# EasyEDA Pro project BioWatch_PCB-DESKTOP-TT52GDR.eprj, schematic Schematic1

## Sheets
1 P1: Create Date: 2023-01-19; Page Name: P1; Project Name: Project Name; Schematic Name: Schematic Name; Update Date: 2021.11.05; Company: EasyEDA.com; Drawed: EasyEDA Pro; Page Size: A4; Part Number: JLCPCB-002; Reviewed: EasyEDA Pro; Version: V0.1
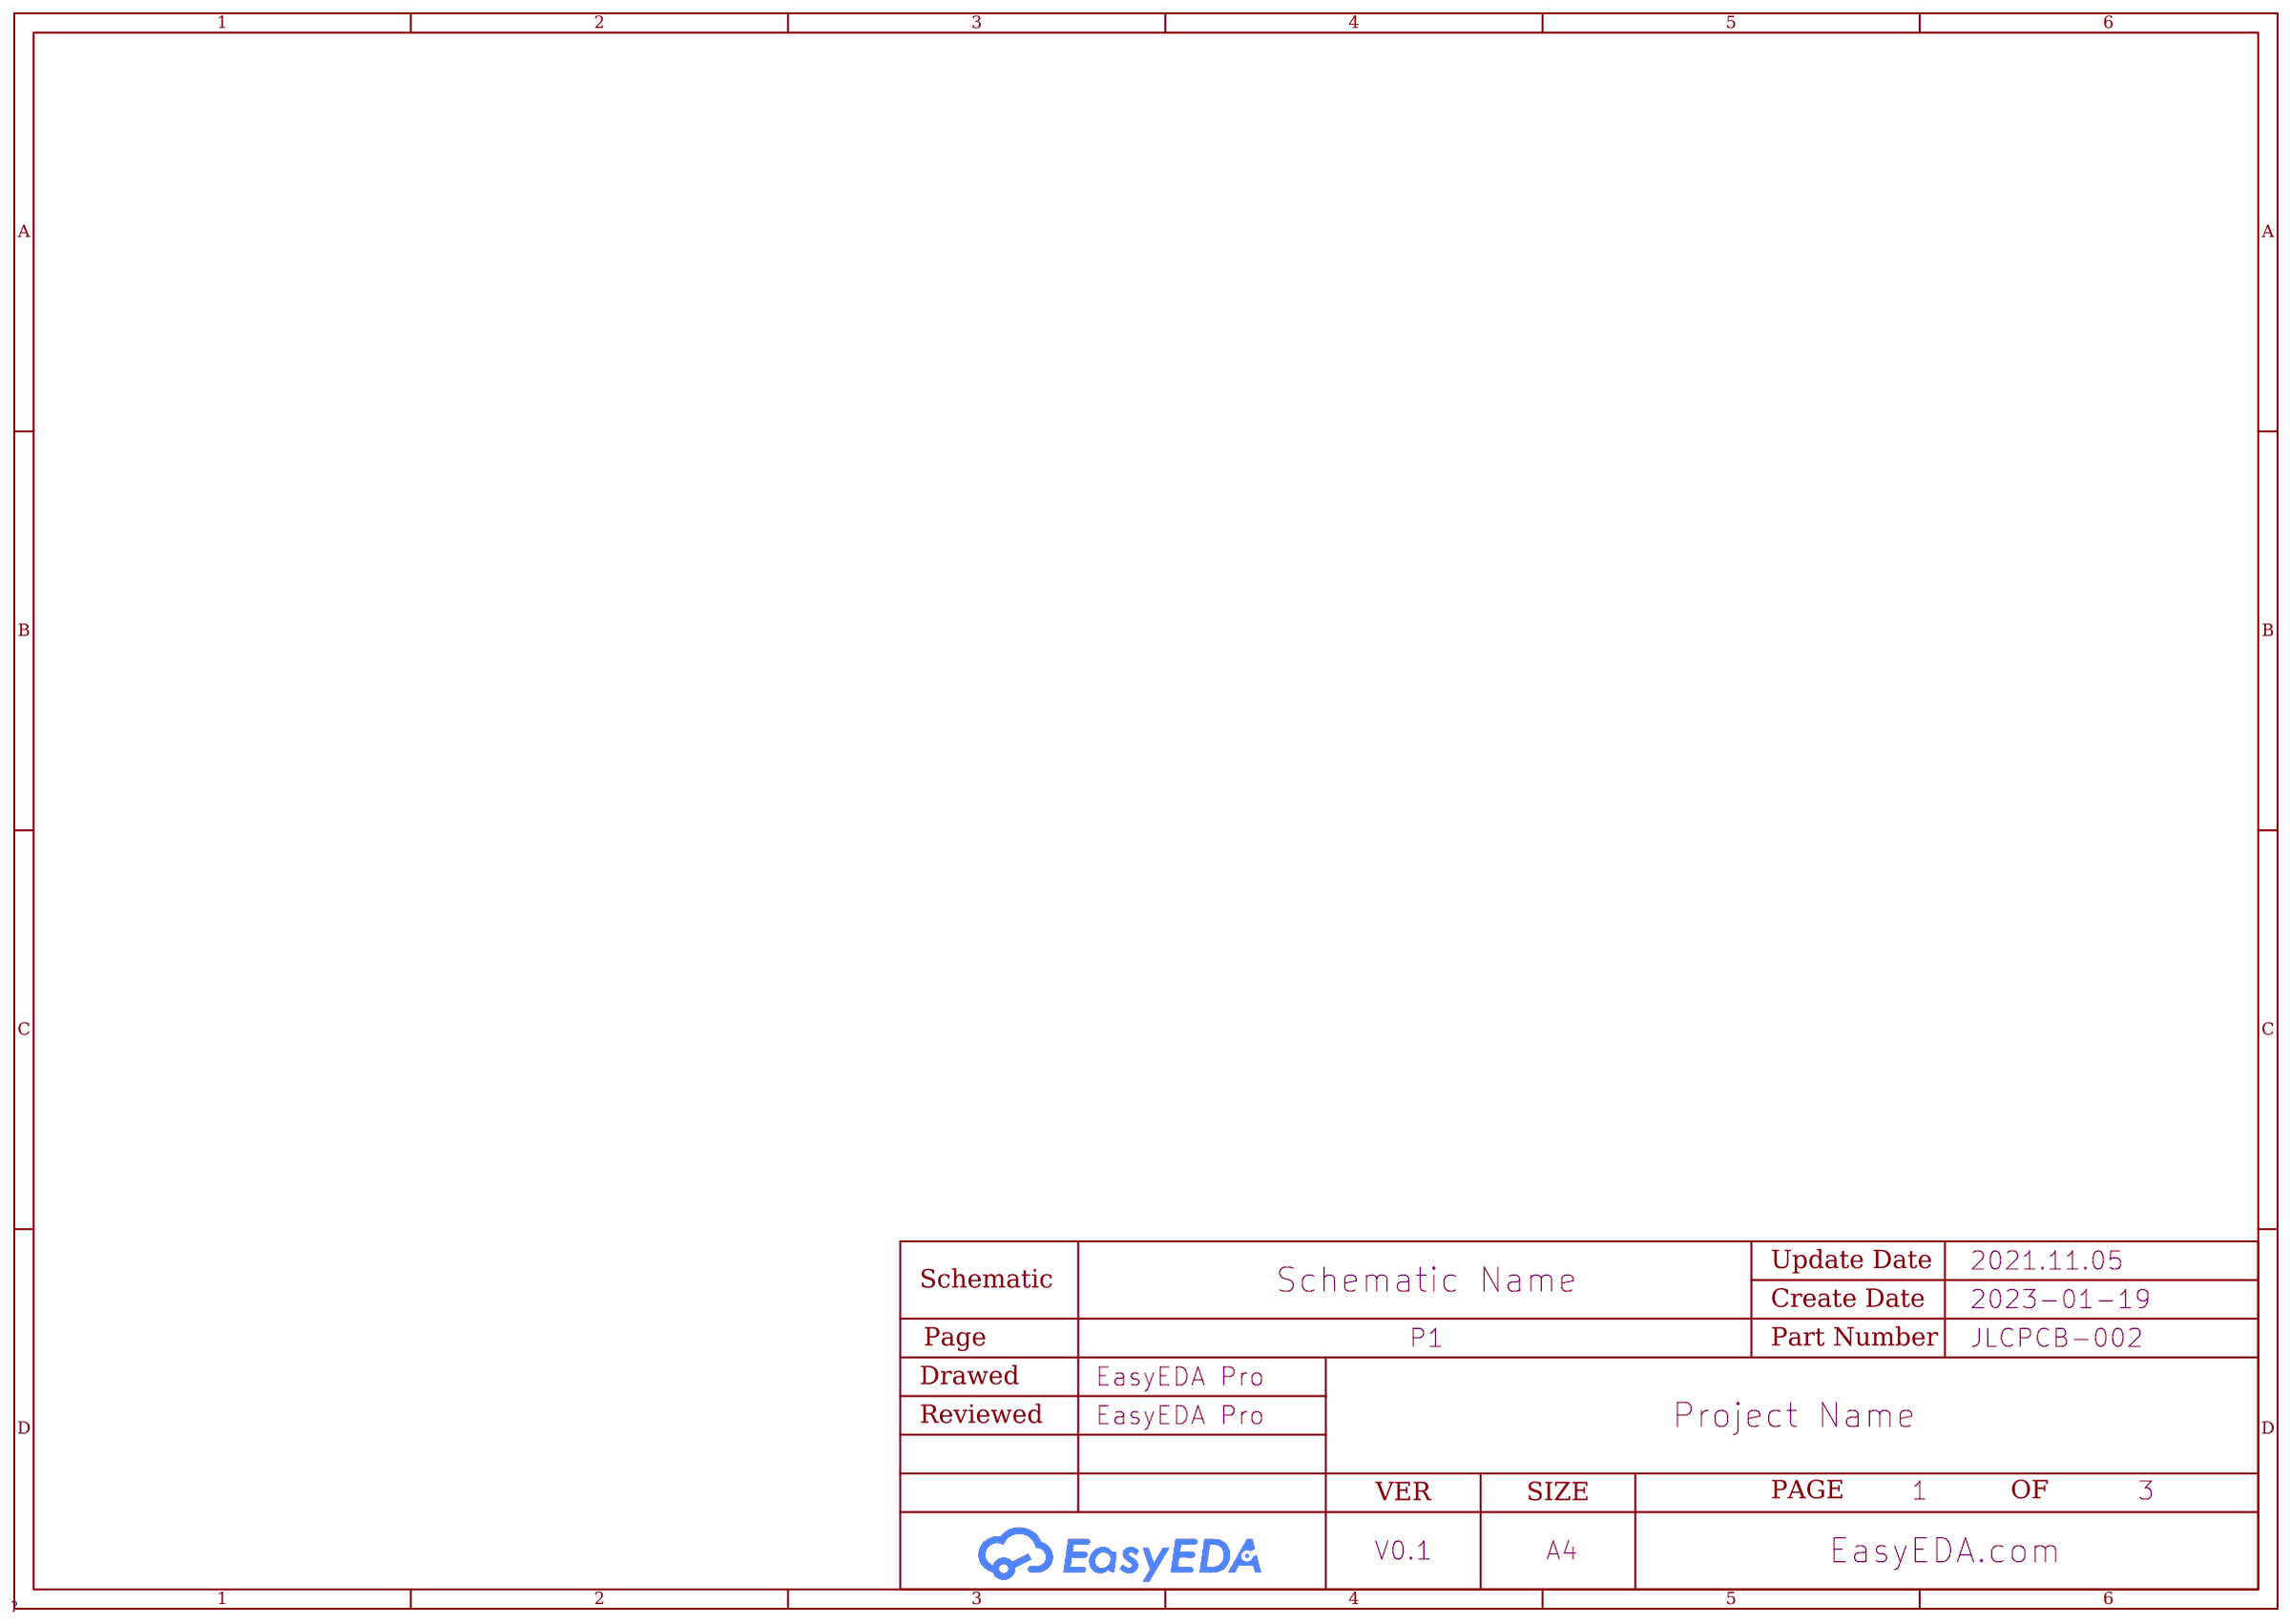
[diagram p1: P1]
2 Sheet_1
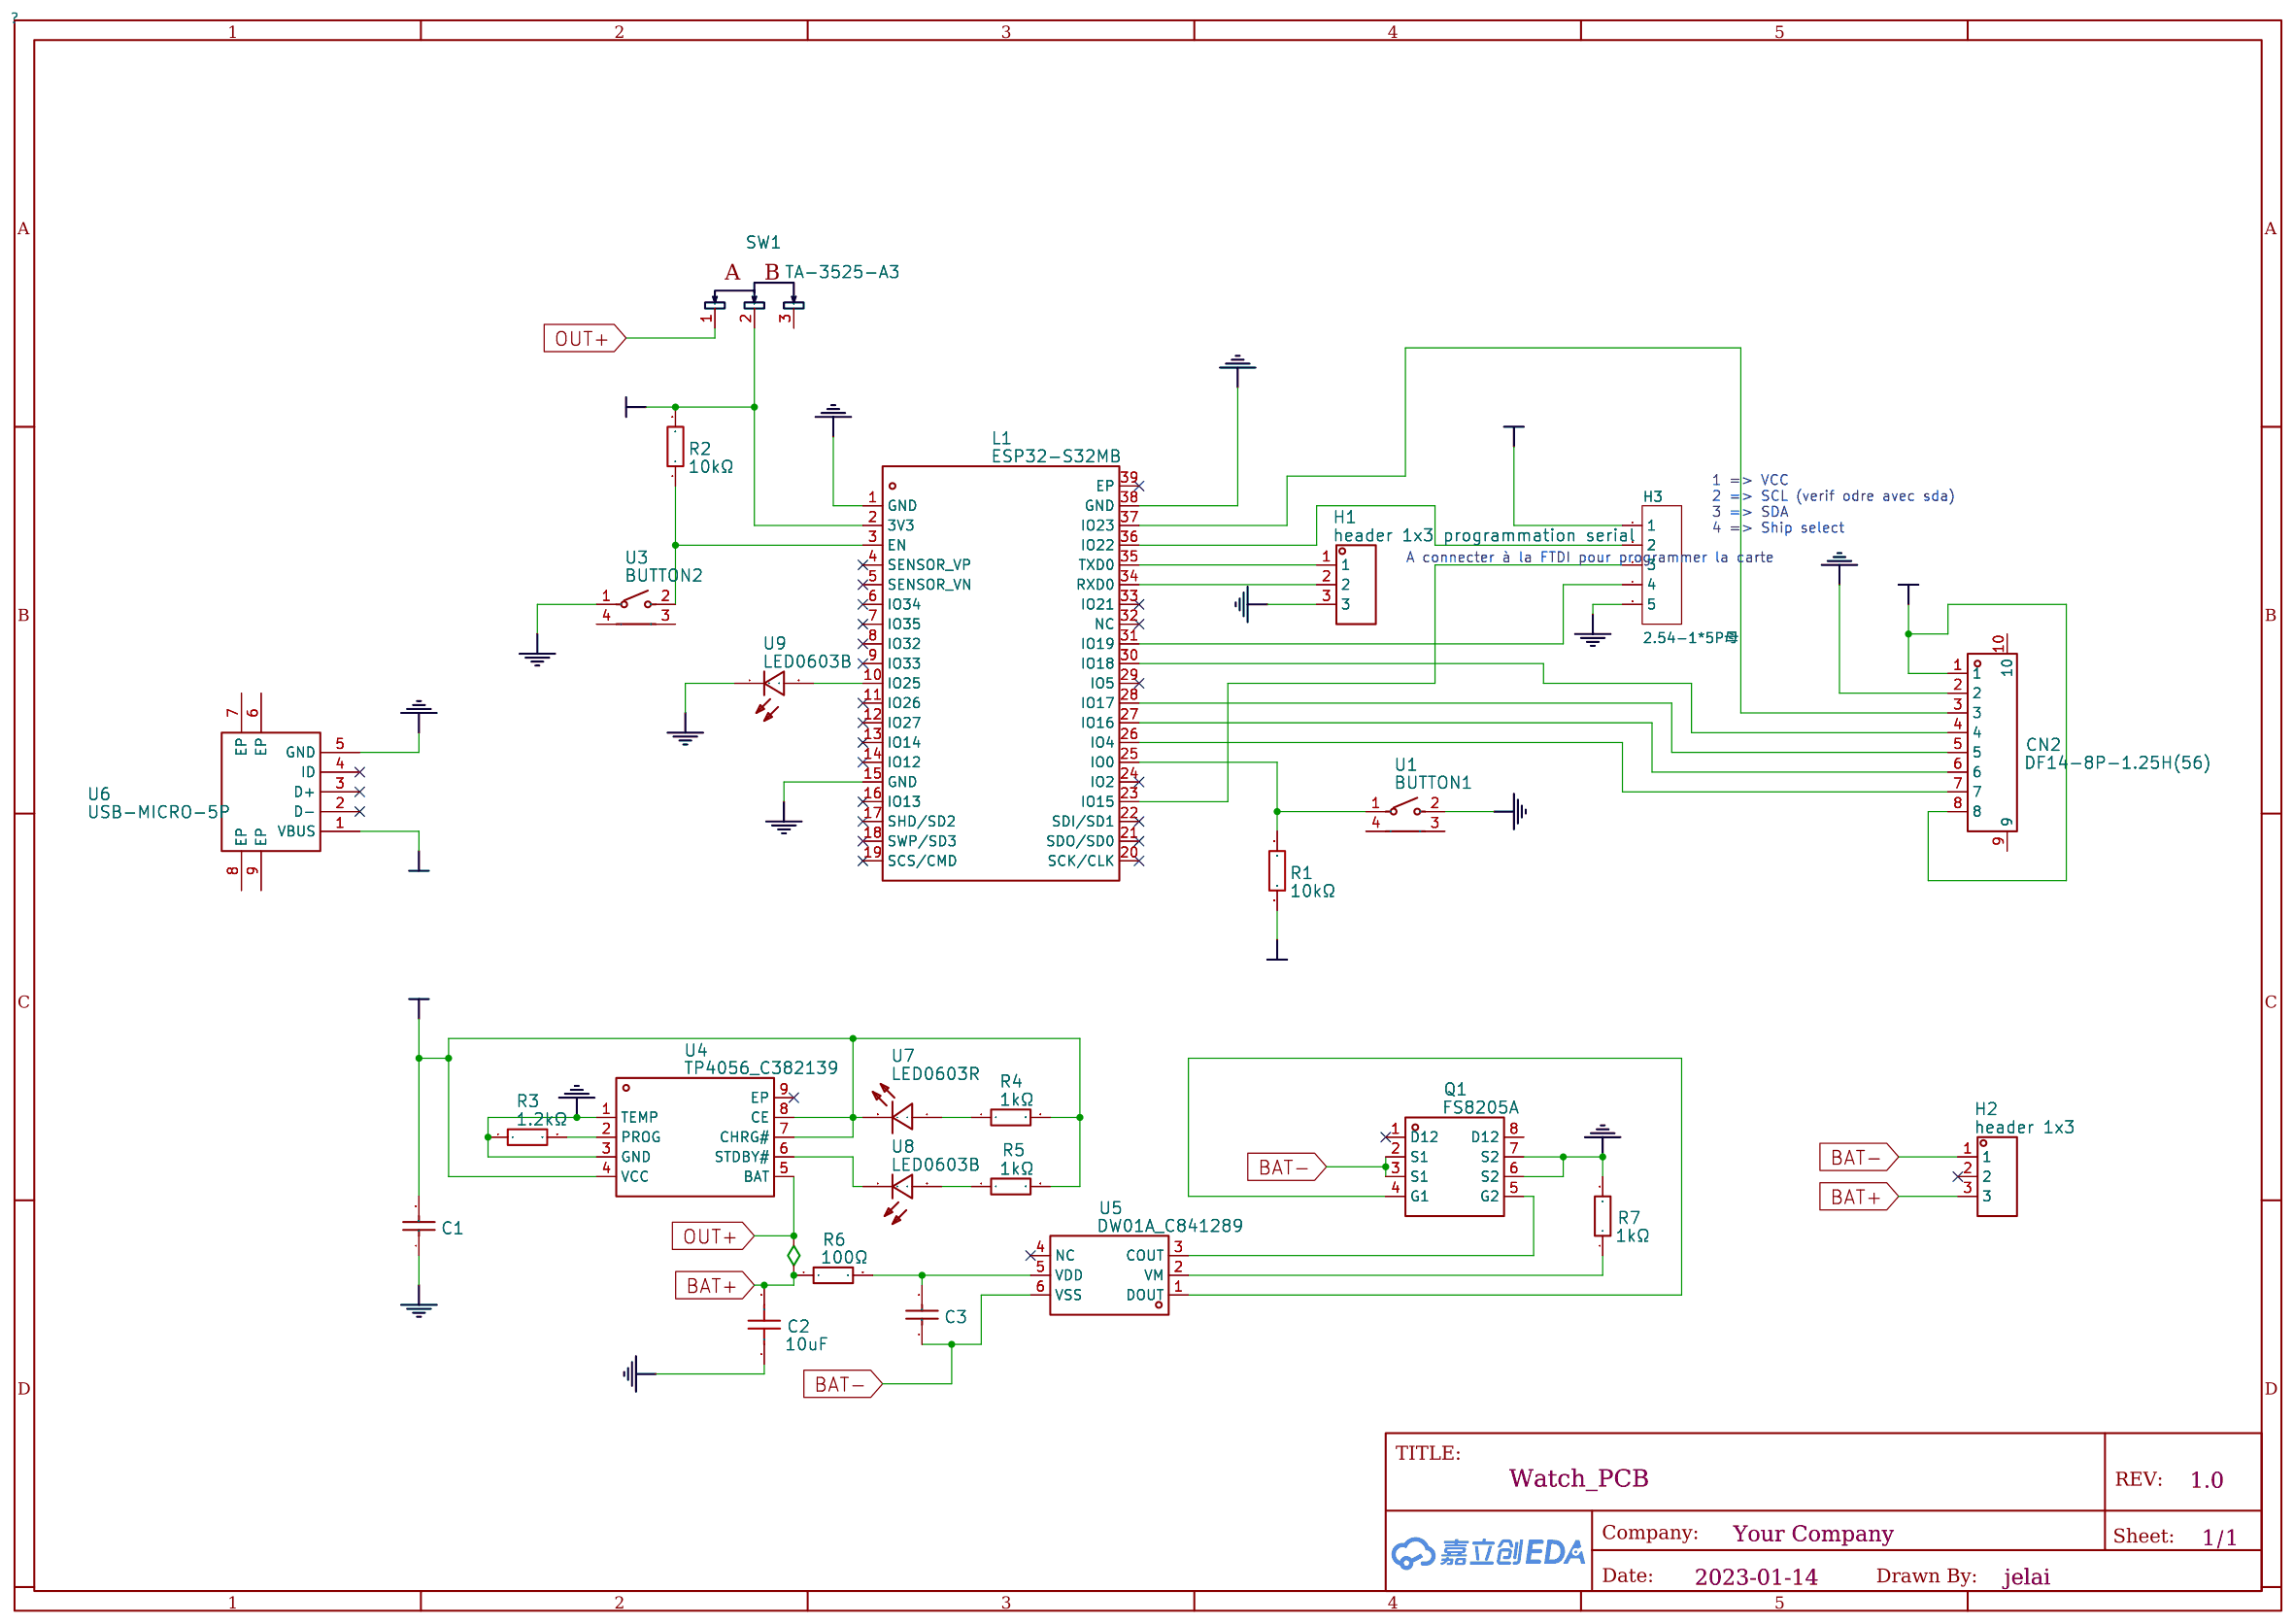
[diagram p2: Sheet_1]

## Parts
C1  CAPCER0.1UF16VX5R0603,CAPCER0.1UF25VX5R0603,CAPCER0.1UF16VX7R0603  [C0603]
C2  10uF  [C0603]
C3  CAPCER0.1UF16VX5R0603,CAPCER0.1UF25VX5R0603,CAPCER0.1UF16VX7R0603  [C0603]
CN2  DF14-8P-1.25H(56)  [CONN-SMD_8P-P1.25_DF14A-8P-1.25H-56]
H1  header 1x3 programmation serial  [HEADER3L]
H2  header 1x3  [HEADER3L]
H3  2.54-1*5P母  [HDR-TH_5P-P2.54-V-F]
L1  ESP32-S32MB  [WIFIM-SMD_ESP32-S32MB]
Q1  FS8205A  [TSSOP-8_L4.4-W3.0-P0.65-LS6.4-BL-2]
R1  10kΩ  [R0603]
R2  10kΩ  [R0603]
R3  1.2kΩ  [R0603]
R4  1kΩ  [R0603]
R5  1kΩ  [R0603]
R6  100Ω  [R0603]
R7  1kΩ  [R0603]
SW1  TA-3525-A3  [SW-SMD_3P-L9.1-W3.5-P2.50-EH6.8]
U1  BUTTON1  [SW-SMD_L7.8-W3.5-P4.00-EH]
U3  BUTTON2  [SW-SMD_L7.8-W3.5-P4.00-EH]
U4  TP4056_C382139  [ESOP-8_L4.9-W3.9-P1.27-LS6.0-BL-EP]
U5  DW01A_C841289  [SOT-23-6_L2.9-W1.6-P0.95-LS2.8-BR]
U6  USB-MICRO-5P  [MICRO-USB-SMD_MICRO-USB-A9]
U7  LED0603R  [LED0603-R-RD]
U8  LED0603B  [LED0603-RD]
U9  LED0603B  [LED0603-RD]

## Library data of the parts
C1 C3 = CAPCER0.1UF16VX5R0603,CAPCER0.1UF25VX5R0603,CAPCER0.1UF16VX7R0603: link: https://item.szlcsc.com/362304.html; 3DModel: C0603_L1.6-W0.8-H0.8; Supplier: LCSC; Supplier Part: C9900012833; Manufacturer: null; JLCPCB Part Class: Extended Part
C2 = 10uF: link: https://item.szlcsc.com/362304.html; 3DModel: C0603_L1.6-W0.8-H0.8; Supplier: LCSC; Supplier Part: C15415; Manufacturer: SAMSUNG(三星); JLCPCB Part Class: Extended Part
CN2 = DF14-8P-1.25H(56): link: https://item.szlcsc.com/626503.html; Supplier: LCSC; Supplier Part: C597887; Manufacturer: HRS(Hirose); JLCPCB Part Class: Extended Part
H1 H2 = header 1x3: Supplier: LCSC; Manufacturer Part: Headers  Pins2.54mm1*10P; image: http://image.lceda.cn/szlcsc/C57369.jpg; Supplier Part: C57369
H3 = 2.54-1*5P母: Number of Rows:单排 Number of Holes:5 Pitch:2.54mm Holes Structure:1x5P Row Spacing:- Mounting Type:Straight Insulation Height:- Contact Material:- Contact Plating:-; LCSC Part Name: 2.54mm 1x5P; Supplier Part: C50950; Manufacturer: BOOMELE(博穆精密); Supplier Footprint: 插件,P=2.54mm; JLCPCB Part Class: Extended Part; Datasheet: https://atta.szlcsc.com/upload/public/pdf/source/20151109/1457707571406.pdf; Supplier: LCSC; Number of Rows: 单排; Number of Holes: 5; Pitch: 2.54mm; Holes Structure: 1x5P; Mounting Type: Straight
L1 = ESP32-S32MB: link: https://item.szlcsc.com/2895630.html; Supplier: LCSC; Supplier Part: C2764096; Manufacturer: Ai-Thinker(安信可); Manufacturer Part: ESP32-S32Mb; JLCPCB Part Class: Extended Part
Q1 = FS8205A: link: https://item.szlcsc.com/109288.html; 3DModel: TSSOP-8_L3.0-W4.4-H1.0-LS6.4-P0.65; Supplier: LCSC; Manufacturer: FORTUNE(富晶); Supplier Part: C16052; JLCPCB Part Class: Extended Part
R1 R2 = 10kΩ: 3DModel: R0603_L1.6-W0.8-H0.8; link: https://www.mouser.in/datasheet/2/447/PYu_RT_1_to_0_01_RoHS_L_11-1669912.pdf; Supplier: LCSC; Supplier Part: C346660; Manufacturer: SEI(Stackpole Electronics Inc.); Manufacturer Part: RNCS0603BKE10K0; Resistance: 10K; JLCPCB Part Class: Extended Part
R3 = 1.2kΩ: 3DModel: R0603_L1.6-W0.8-H0.8; link: https://www.mouser.in/datasheet/2/447/PYu_RT_1_to_0_01_RoHS_L_11-1669912.pdf; Supplier: LCSC; Supplier Part: C269681; Manufacturer: Tyohm(幸亚电阻); Manufacturer Part: RMC06031.2K5%N; Resistance: 1.2K; JLCPCB Part Class: Extended Part
R4 R5 R7 = 1kΩ: 3DModel: R0603_L1.6-W0.8-H0.8; link: https://www.mouser.in/datasheet/2/447/PYu_RT_1_to_0_01_RoHS_L_11-1669912.pdf; Supplier: LCSC; Manufacturer: UNI-ROYAL(厚声); Manufacturer Part: 0603WAD1001T5E; Supplier Part: C51218; Resistance: 1K; JLCPCB Part Class: Extended Part
R6 = 100Ω: 3DModel: R0603_L1.6-W0.8-H0.8; link: https://www.mouser.in/datasheet/2/447/PYu_RT_1_to_0_01_RoHS_L_11-1669912.pdf; Supplier: LCSC; Manufacturer: LIZ(丽智电子); Manufacturer Part: CR0603FA1000G; Supplier Part: C100700; Resistance: 100; JLCPCB Part Class: Extended Part
SW1 = TA-3525-A3: link: https://item.szlcsc.com/529154.html?ref=editor&logined=true; Supplier: LCSC; Supplier Part: C514020; Manufacturer: Yuandi(元迪); JLCPCB Part Class: Extended Part
U1 U3 = BUTTONTACT_3X6X3.5: link: https://img.jlc.com/image//data/smt-stock-produce/componentSizePhoto/2021-12-22/ee97923d27ba48989625686833333d98/BG2112210604_D21122000046_font.png; Supplier: LCSC; Supplier Part: C9900004514; Manufacturer: null; Manufacturer Part: ButtonTACT_3x6x3.5; JLCPCB Part Class: Extended Part
U4 = TP4056_C382139: link: https://www.mornsun.cn/html/pdf/SCM1501B.html; 3DModel: ESOP-8_L4.9-W3.9-H1.6-LS6.0-P1.27; Supplier: LCSC; Supplier Part: C382139; Manufacturer: TPOWER(天源); Manufacturer Part: TP4056; JLCPCB Part Class: Extended Part
U5 = DW01A_C841289: link: https://item.szlcsc.com/169042.html; 3DModel: SOT-23-6_L2.9-W1.6-H1.5-LS2.8-P0.95; Supplier: LCSC; Supplier Part: C841289; Manufacturer: Shenzhen Fuman Elec; Manufacturer Part: DW01A; JLCPCB Part Class: Extended Part
U6 = USB-MICRO-5P: link: https://item.szlcsc.com/157113.html; Supplier: LCSC; Supplier Part: C9900014288; Manufacturer: null; Manufacturer Part: USB-Micro-5P; JLCPCB Part Class: Extended Part
U7 = LED0603R: link: https://lcsc.com/product-detail/Light-Emitting-Diodes-LED_Hubei-KENTO-Elec-0603-Green_C12624.html; Supplier: LCSC; Supplier Part: C9900017730; Manufacturer: null; JLCPCB Part Class: Extended Part
U8 U9 = LED0603B: link: https://item.szlcsc.com/347874.html; Supplier: LCSC; Supplier Part: C9900005354; Manufacturer: null; JLCPCB Part Class: Extended Part

## Nets
+5V: C1.2 R4.2 R5.2 U4.4(VCC) U4.7(CHRG#) U4.8(CE) U6.1(VBUS) U7.2(-)
GND: C1.1 C2.1 CN2.2 H1.3 H3.5 L1.1(GND) L1.15(GND) L1.38(GND) Q1.6(S2) Q1.7(S2) R3.1 R7.2 U1.2 U3.1 U4.1(TEMP) U4.3(GND) U6.5(GND) U9.1(K)
VCC: CN2.1 CN2.8 H3.1 L1.2(3V3) R1.1 R2.2 SW1.2
BAT+: C2.2 H2.3 R6.1 SW1.1 U4.5(BAT)
BAT-: C3.1 H2.1 Q1.2(S1) Q1.3(S1) U5.6(VSS)
Net-(C3-2): C3.2 R6.2 U5.5(VDD)
Net-(CN2-3): CN2.3 L1.37(IO23)
Net-(CN2-4): CN2.4 L1.30(IO18)
Net-(CN2-5): CN2.5 L1.28(IO17)
Net-(CN2-6): CN2.6 L1.27(IO16)
Net-(CN2-7): CN2.7 L1.26(IO4)
Net-(H1-1): H1.1 L1.35(TXD0)
Net-(H1-2): H1.2 L1.34(RXD0)
Net-(H3-2): H3.2 L1.36(IO22)
Net-(H3-3): H3.3 L1.23(IO15)
Net-(H3-4): H3.4 L1.31(IO19)
Net-(L1-3): L1.3(EN) R2.1 U3.2
Net-(L1-10): L1.10(IO25) U9.2(A)
Net-(L1-25): L1.25(IO0) R1.2 U1.1
Net-(Q1-4): Q1.4(G1) U5.1(DOUT)
Net-(Q1-5): Q1.5(G2) U5.3(COUT)
Net-(R3-2): R3.2 U4.2(PROG)
Net-(R4-1): R4.1 U7.1(+)
Net-(R5-1): R5.1 U8.2(A)
Net-(R7-1): R7.1 U5.2(VM)
Net-(U4-6): U4.6(STDBY#) U8.1(K)

Not connected (* = marked no-connect by the designer): CN2 9 10; H2 2*; L1 4(SENSOR_VP)* 5(SENSOR_VN)* 6(IO34)* 7(IO35)* 8(IO32)* 9(IO33)* 11(IO26)* 12(IO27)* 13(IO14)* 14(IO12)* 16(IO13)* 17(SHD/SD2)* 18(SWP/SD3)* 19(SCS/CMD)* 20(SCK/CLK)* 21(SDO/SD0)* 22(SDI/SD1)* 24(IO2)* 29(IO5)* 32(NC)* 33(IO21)* 39(EP)*; Q1 1(D12)* 8(D12); SW1 3; U1 3 4; U3 3 4; U4 9(EP)*; U5 4(NC)*; U6 2(D-)* 3(D+)* 4(ID)* 6(EP) 7(EP) 8(EP) 9(EP)

## Notes on the sheets
sheet 2
- 1 => VCC
  2 => SCL (verif odre avec sda)
  3 => SDA
  4 => Ship select
- A connecter à la FTDI pour programmer la carte
